# EAGLE design attiny84 (EAGLE 7.5.0)
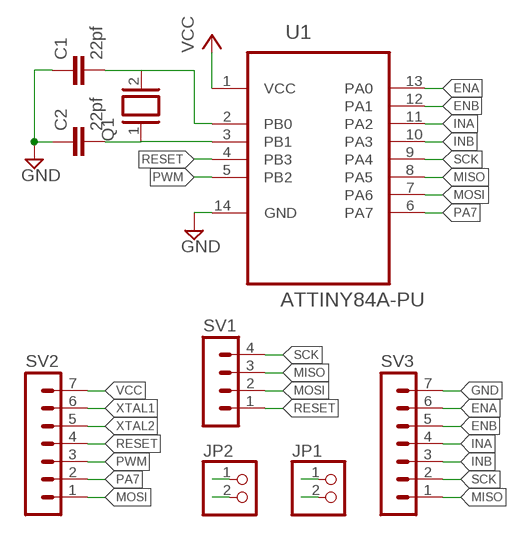
[diagram p0: schematic, sheet 1]

## Parts
C1  22pf  C2.5/2  [C2.5-2]
C2  22pf  C2.5/2  [C2.5-2]
JP1  PINHD-1X2  [1X02]
JP2  PINHD-1X2  [1X02]
Q1  XTAL/S  [QS]
SV1  MA04-1  [MA04-1]
SV2  MA07-1  [MA07-1]
SV3  MA07-1  [MA07-1]
U1  ATTINY84A-PU  [DIP254P762X533-14]

## Nets
ENA: SV3.6 U1.13(PA0)
ENB: SV3.5 U1.12(PA1)
GND: C1.1 C2.1 JP1.1 JP1.2 SV3.7 U1.14(GND)
INA: SV3.4 U1.11(PA2)
INB: SV3.3 U1.10(PA3)
MISO: SV1.3 SV3.1 U1.8(PA5)
MOSI: SV1.2 SV2.1 U1.7(PA6)
PA7: SV2.2 U1.6(PA7)
PWM: SV2.3 U1.5(PB2)
RESET: SV1.1 SV2.4 U1.4(PB3)
SCK: SV1.4 SV3.2 U1.9(PA4)
VCC: JP2.1 JP2.2 SV2.7 U1.1(VCC)
XTAL1: C1.2 Q1.2 SV2.6 U1.2(PB0)
XTAL2: C2.2 Q1.1 SV2.5 U1.3(PB1)

## Library data of the parts
C1 C2 = capacitor-wima:C: CAPACITOR naming: grid - package width
JP1 JP2 = pinhead:PINHD-1X2: PIN HEADER
Q1 = special:XTAL/S: CRYSTAL
SV1 = con-lstb:MA04-1: PIN HEADER; OC_FARNELL: unknown; OC_NEWARK: unknown
SV2 SV3 = con-lstb:MA07-1: PIN HEADER; OC_FARNELL: unknown; OC_NEWARK: unknown
U1 = Attiny84:ATTINY84A-PU: Microcontroller with 2K/4K/8K Bytes In-System Programmable Flash,PDIP-14; MPN: ATTINY84A-PU; OC_FARNELL: 1972172; OC_NEWARK: 68T3792; PACKAGE: PDIP-14; SUPPLIER: ATMEL

## Board
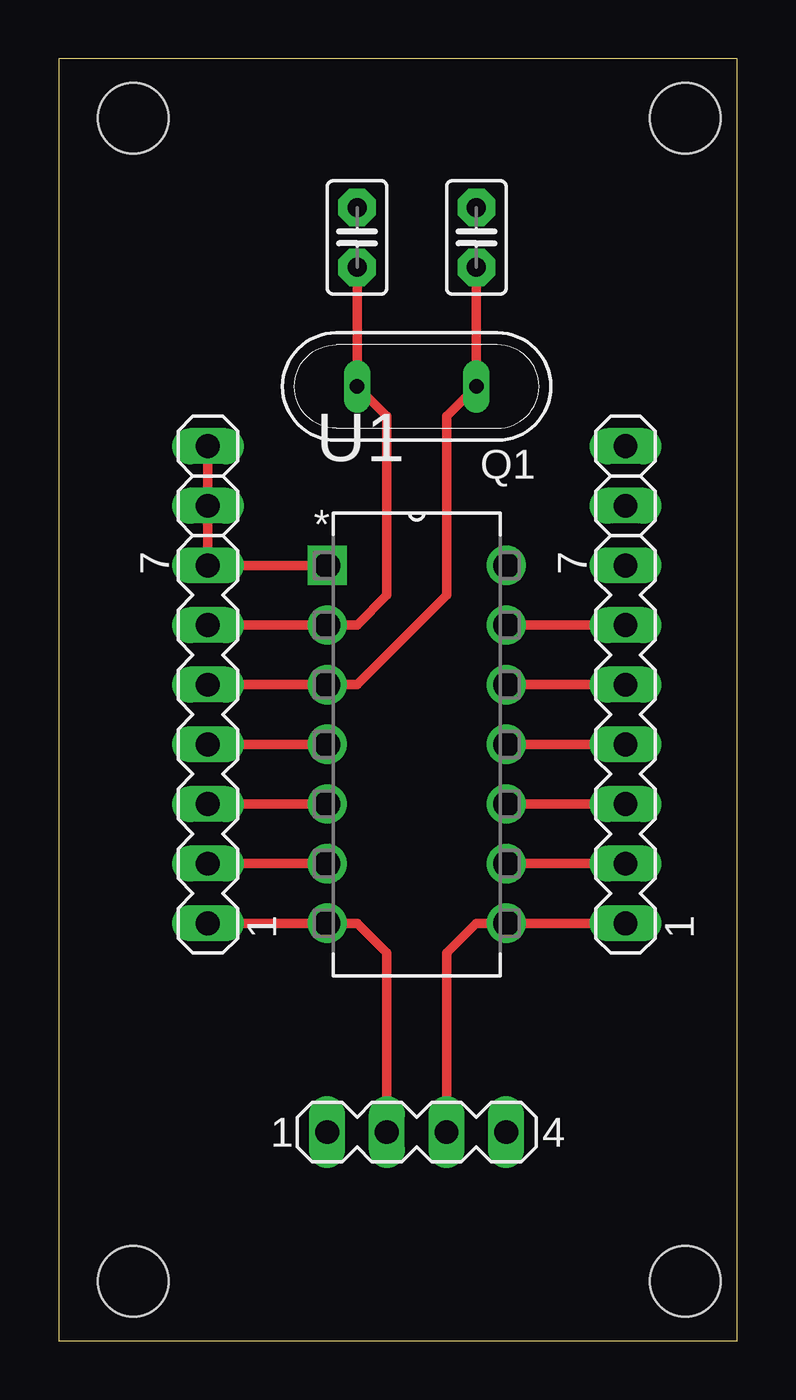
[diagram p1: board, top side]
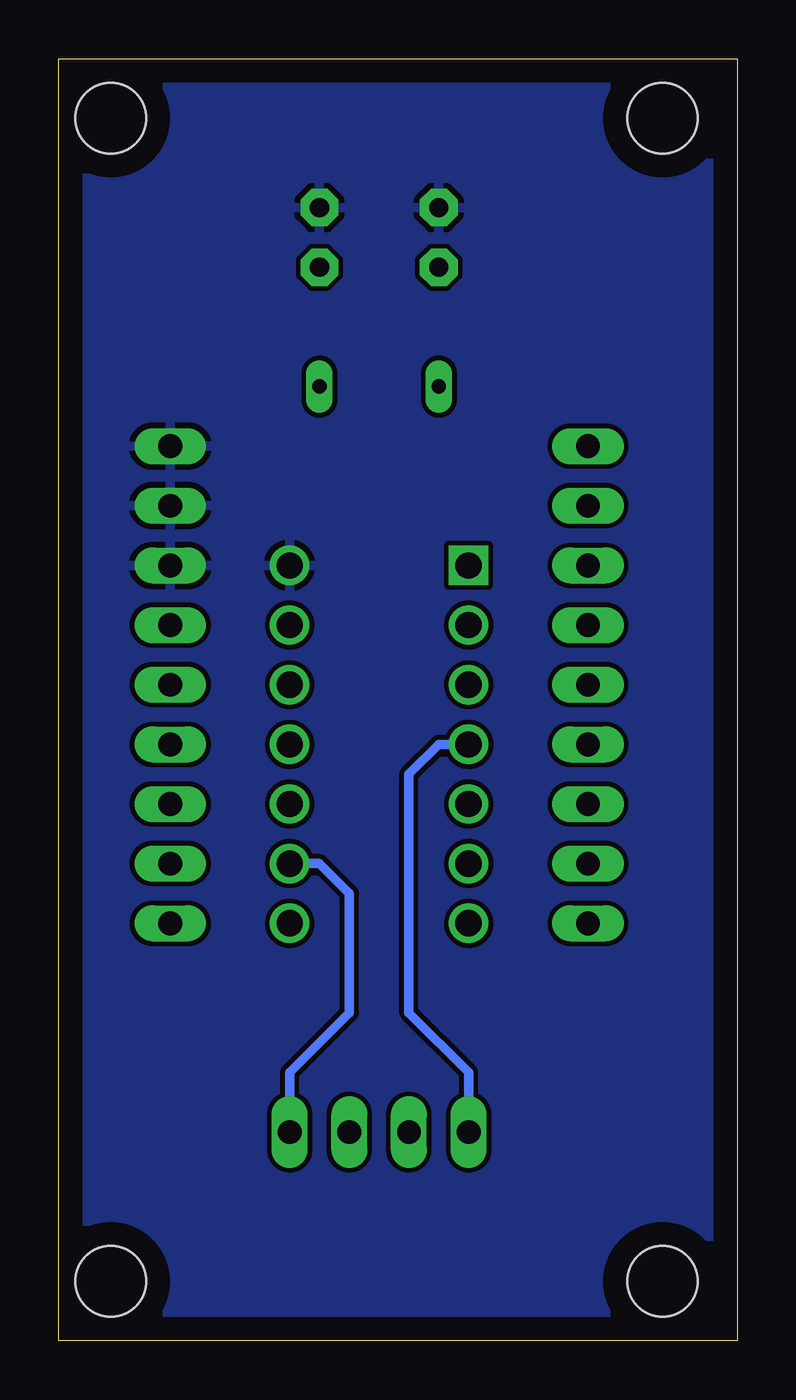
[diagram p2: board, bottom side, seen from below]

Size 28.88 x 54.6 mm. Coordinates in mm from the lower left corner, seen from the top.
Outline: 0,0 28.88,0 28.88,54.6 0,54.6 0,0
Copper layers (1*16): Top 0.035mm / dielectric 1.5mm / Bottom 0.035mm
Design rules "default": minimum track width 10mil, minimum drill 24mil, track to track 8mil, track to pad 8mil, pad to pad 8mil, via to via 8mil, smd to smd 8mil, copper to edge 40mil, drill to drill 8mil, minimum pad ring 10mil, minimum via ring 8mil, stop-mask expansion 4mil, vias tented up to drill 0mil, thermal gap 10mil
Holes 3 mm at 3.17,52.07 26.67,52.07 3.17,2.54 26.67,2.54

### Footprints (pad centres in the part's own frame; a part is rotated, then mirrored left to right if it is on the bottom)
C2.5-2 = drill 0.813 pad 1.6 octagon: 1 -1.27,0; 2 1.27,0
1X02 = drill 1.016 long: 1 -1.27,0; 2 1.27,0
QS = drill 0.61 long: 1 -2.54,0; 2 2.54,0
MA04-1 = drill 1.016 long: 1 -3.81,0; 2 -1.27,0; 3 1.27,0; 4 3.81,0
MA07-1 = drill 1.016 long: 1 -7.62,0; 2 -5.08,0; 3 -2.54,0; 4 0,0; 5 2.54,0; 6 5.08,0; 7 7.62,0
DIP254P762X533-14 = drill 1.118 square: 1 -7.62,15.24 | drill 1.118: 2 -7.62,12.7; 3 -7.62,10.16; 4 -7.62,7.62; 5 -7.62,5.08; 6 -7.62,2.54; 7 -7.62,0; 8 0,0; 9 0,2.54; 10 0,5.08; 11 0,7.62; 12 0,10.16; 13 0,12.7; 14 0,15.24

### Placement (x,y rotation side)
C1  12.7,46.99 270 top
C2  17.78,46.99 270 top
JP1  24.13,36.83 90 top
JP2  6.35,36.83 90 top
Q1  15.24,40.64 180 top
SV1  15.24,8.89 0 top
SV2  6.35,25.4 90 top
SV3  24.13,25.4 90 top
U1  19.05,17.78 0 top

### Tracks (layer width: path | path; a pad name or v marks a point on that pad's centre or on a via)
ENA
  Top 0.406: U1.13 SV3.6
ENB
  Top 0.406: U1.12 SV3.5
GND
  pour Bottom: -1.27,55.88 -1.27,-1.27 30.48,-1.27 30.48,55.88
INA
  Top 0.406: U1.11 SV3.4
INB
  Top 0.406: U1.10 SV3.3
MISO
  Top 0.406: SV3.1 U1.8 17.78,17.78 16.51,16.51 SV1.3
MOSI
  Top 0.406: SV2.1 U1.7 12.7,17.78 13.97,16.51 SV1.2
PA7
  Top 0.406: SV2.2 U1.6
PWM
  Top 0.406: SV2.3 U1.5
RESET
  Top 0.406: SV2.4 U1.4
  Bottom 0.406: SV1.1 11.43,11.43 13.97,13.97 13.97,24.13 12.7,25.4 U1.4
SCK
  Top 0.406: U1.9 SV3.2
  Bottom 0.406: SV1.4 19.05,11.43 16.51,13.97 16.51,19.05 17.78,20.32 U1.9
VCC
  Top 0.406: U1.1 SV2.7 JP2.1 JP2.2
XTAL1
  Top 0.406: SV2.6 U1.2 12.7,30.48 13.97,31.75 13.97,39.37 Q1.2 C1.2
XTAL2
  Top 0.406: SV2.5 U1.3 12.7,27.94 16.51,31.75 16.51,39.37 Q1.1 C2.2